# EAGLE design old_main_board (EAGLE 7.7.0)
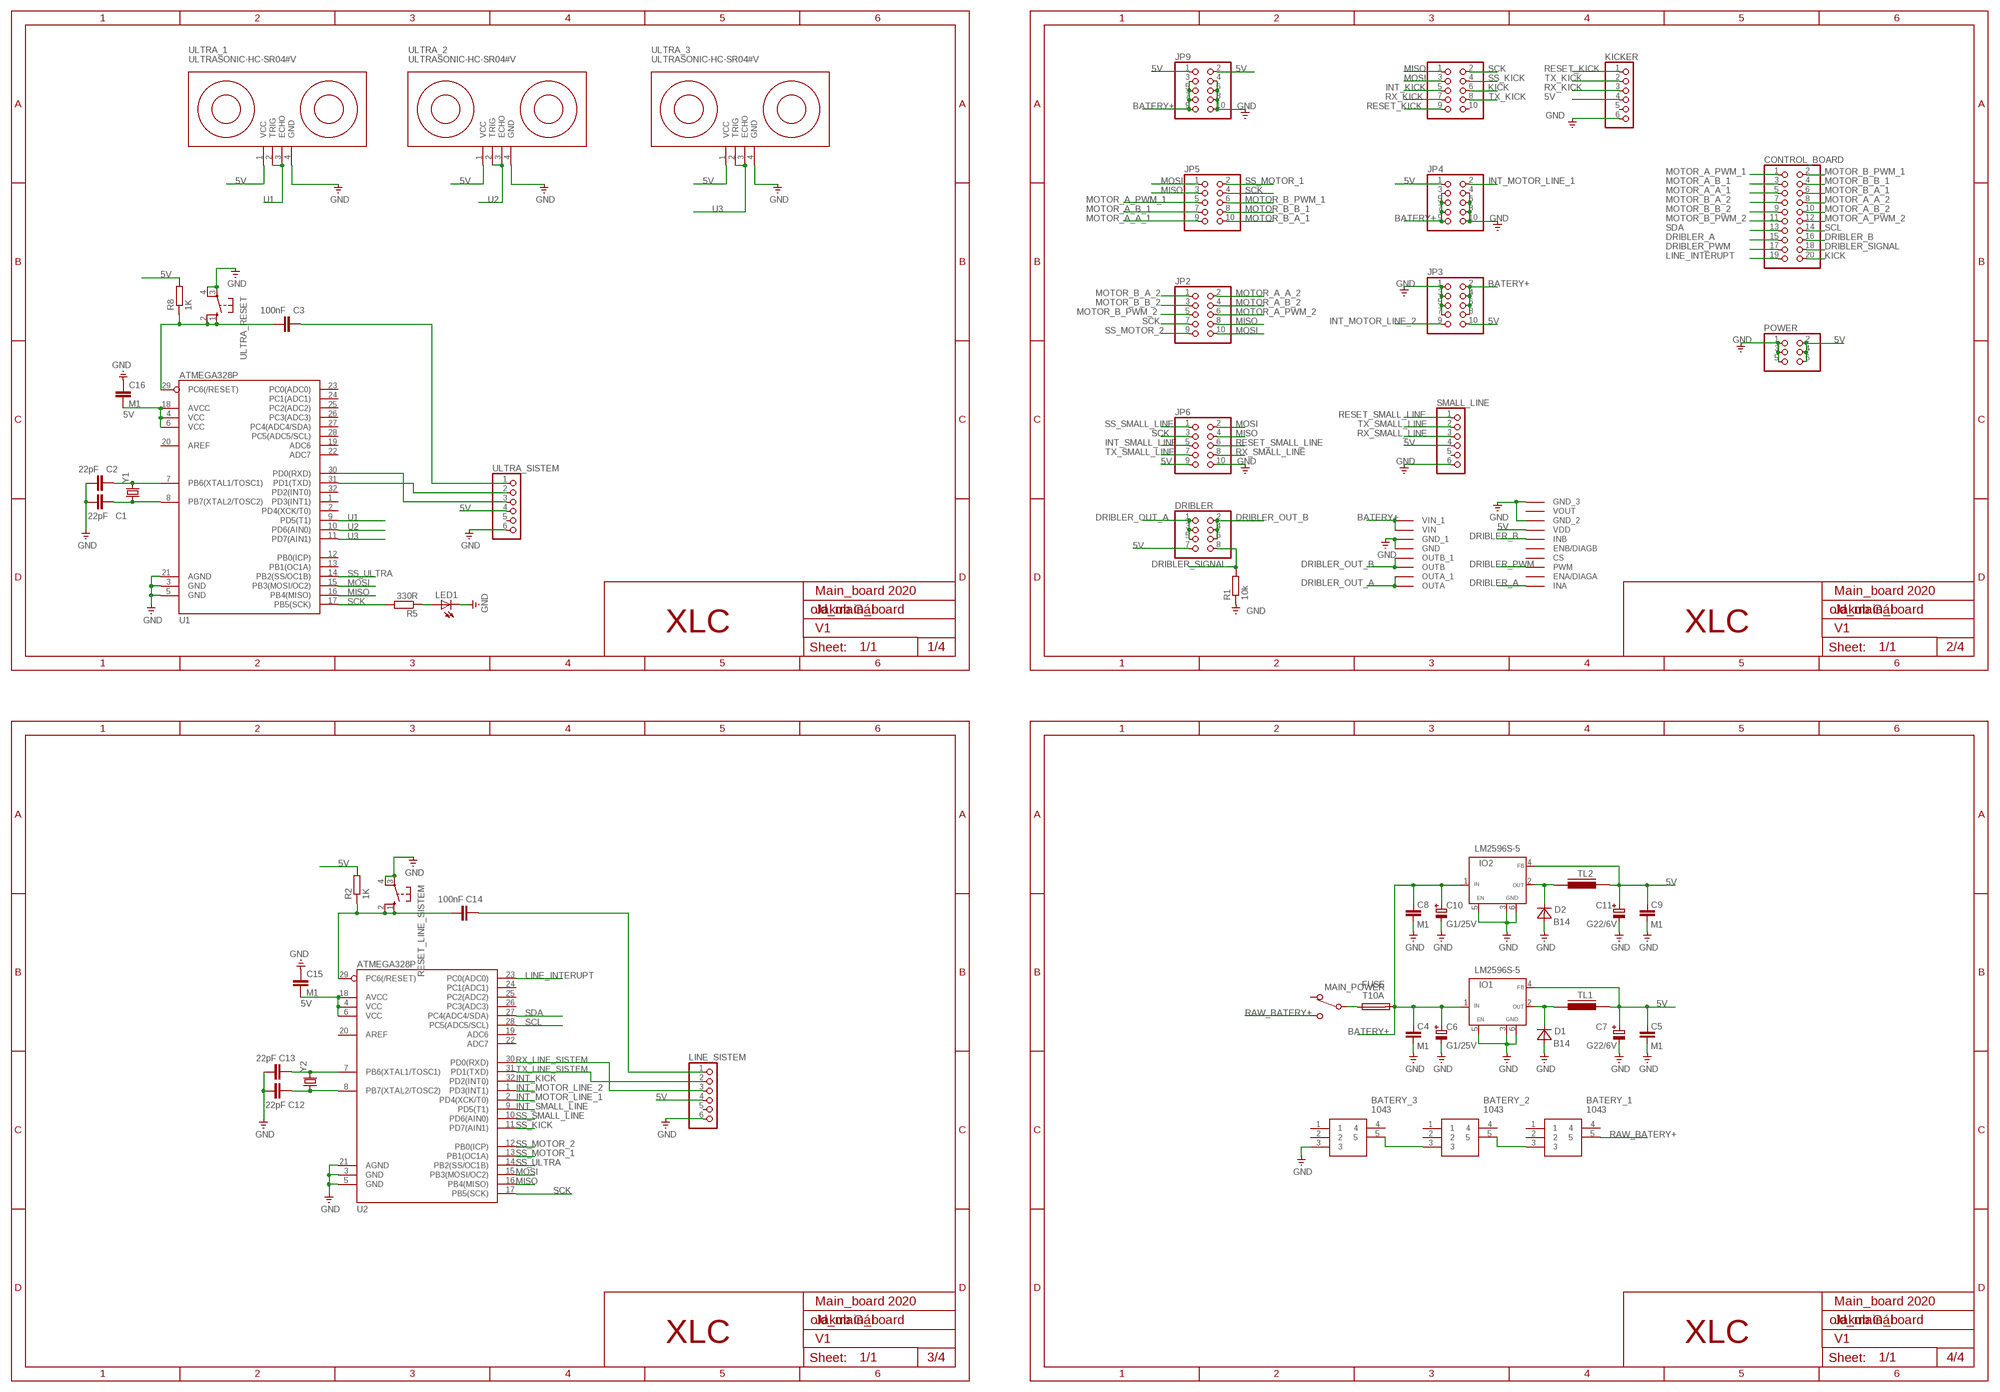
[diagram p0: schematic, sheet 1]

## Parts
BATERY_1  1043  [1043]
BATERY_2  1043  [1043]
BATERY_3  1043  [1043]
C1  22pF  C-EUC0603  [C0603]
C2  22pF  C-EUC0603  [C0603]
C3  100nF  C-EUC0603  [C0603]
C4  M1  KOND-KERAM1206-SMD  [SMD-1206]
C5  M1  KOND-KERAM1206-SMD  [SMD-1206]
C6  G1/25V  KOND-ELEKTD-SMD  [SMD-ELE-D]
C7  G22/6V  KOND-ELEKTD-SMD  [SMD-ELE-D]
C8  M1  KOND-KERAM1206-SMD  [SMD-1206]
C9  M1  KOND-KERAM1206-SMD  [SMD-1206]
C10  G1/25V  KOND-ELEKTD-SMD  [SMD-ELE-D]
C11  G22/6V  KOND-ELEKTD-SMD  [SMD-ELE-D]
C12  22pF  C-EUC0603  [C0603]
C13  22pF  C-EUC0603  [C0603]
C14  100nF  C-EUC0603  [C0603]
C15  M1  C-EUC0603  [C0603]
C16  M1  C-EUC0603  [C0603]
CONTROL_BOARD  PINHD-2X10_2.54-SMD  [2X10SMD]
D1  B14  DIODASMD-3,6X5,5  [D-3,6X5,5]
D2  B14  DIODASMD-3,6X5,5  [D-3,6X5,5]
DRIBLER  PINHD-2X4_2.54-SMD  [2X04SMD]
FUSE  T10A  POISTKA2A  [SH22,5A]
IO1  LM2596S-5  LM2596S  [TO263-5]
IO2  LM2596S-5  LM2596S  [TO263-5]
JP2  PINHD-2X5_2.54-SMD  [2X05SMD]
JP3  PINHD-2X5_2.54-SMD  [2X05SMD]
JP4  PINHD-2X5_2.54-SMD  [2X05SMD]
JP5  PINHD-2X5_2.54-SMD  [2X05SMD]
JP6  PINHD-2X5_2.54-SMD  [2X05SMD]
JP8  PINHD-2X5_2.54-SMD  [2X05SMD]
JP9  PINHD-2X5_2.54-SMD  [2X05SMD]
KICKER  PINHD-1X6  [1X06]
LED1  LEDCHIPLED_0603  [CHIPLED_0603]
LINE_SISTEM  PINHD-1X6  [1X06]
MAIN_POWER  PREP-1PB  [P-B069B]
POWER  PINHD-2X3_2.54-SMD  [2X03SMD]
R1  10k  R-EU_R0603  [R0603]
R2  1K  R-EU_R0603  [R0603]
R5  330R  R-EU_R0603  [R0603]
R8  1K  R-EU_R0603  [R0603]
RESET_LINE_SISTEM  10-XX  [B3F-10XX]
SMALL_LINE  PINHD-1X6  [1X06]
TL1  INDUK-TLSMD1  [INDUK-TL]
TL2  INDUK-TLSMD1  [INDUK-TL]
U1  ATMEGA328P  ATMEGA328_SMT  [TQFP32-08]
U2  ATMEGA328P  ATMEGA328_SMT  [TQFP32-08]
U$4  MOTOR_DRIVER  [MOTOR_DRIVER]
ULTRA_1  ULTRASONIC-HC-SR04#V  [ULTRASONIC-HC-SR04#V]
ULTRA_2  ULTRASONIC-HC-SR04#V  [ULTRASONIC-HC-SR04#V]
ULTRA_3  ULTRASONIC-HC-SR04#V  [ULTRASONIC-HC-SR04#V]
ULTRA_RESET  10-XX  [B3F-10XX]
ULTRA_SISTEM  PINHD-1X6  [1X06]
Y1  CRYSTALHC49US  [HC49US]
Y2  CRYSTALHC49US  [HC49US]

## Nets
5V: C5.2 C7.PLUS C9.2 C11.PLUS C15.2 C16.2 DRIBLER.7 IO1.4(FB) IO2.4(FB) JP3.10 JP4.1 JP6.9 JP9.1 JP9.2 KICKER.4 LINE_SISTEM.4 POWER.2 POWER.4 POWER.6 R2.2 R8.2 SMALL_LINE.4 TL1.2 TL2.2 U1.4(VCC) U1.6(VCC) U1.18(AVCC) U2.4(VCC) U2.6(VCC) U2.18(AVCC) U$4.VDD ULTRA_1.1(VCC) ULTRA_2.1(VCC) ULTRA_3.1(VCC) ULTRA_SISTEM.4
BATERY+: C4.2 C6.PLUS C8.2 C10.PLUS FUSE.2 IO1.1(IN) IO2.1(IN) JP3.2 JP3.4 JP3.6 JP3.8 JP4.3 JP4.5 JP4.7 JP4.9 JP9.3 JP9.5 JP9.7 JP9.9 U$4.VIN U$4.VIN_1
DRIBLER_A: CONTROL_BOARD.15 U$4.INA
DRIBLER_B: CONTROL_BOARD.16 U$4.INB
DRIBLER_OUT_A: DRIBLER.1 DRIBLER.3 DRIBLER.5 U$4.OUTA U$4.OUTA_1
DRIBLER_OUT_B: DRIBLER.2 DRIBLER.4 DRIBLER.6 U$4.OUTB U$4.OUTB_1
DRIBLER_PWM: CONTROL_BOARD.17 U$4.PWM
DRIBLER_SIGNAL: CONTROL_BOARD.18 DRIBLER.8 R1.2
GND: BATERY_3.3 C1.1 C2.1 C4.1 C5.1 C6.MINUS C7.MINUS C8.1 C9.1 C10.MINUS C11.MINUS C12.1 C13.1 C15.1 C16.1 D1.A D2.A IO1.3(GND) IO1.5(EN) IO1.6(GND) IO2.3(GND) IO2.5(EN) IO2.6(GND) JP3.1 JP3.3 JP3.5 JP3.7 JP4.4 JP4.6 JP4.8 JP4.10 JP6.10 JP9.4 JP9.6 JP9.8 JP9.10 KICKER.6 LED1.C LINE_SISTEM.6 POWER.1 POWER.3 POWER.5 R1.1 RESET_LINE_SISTEM.3(P) RESET_LINE_SISTEM.4(P1) SMALL_LINE.6 U1.3(GND) U1.5(GND) U1.21(AGND) U2.3(GND) U2.5(GND) U2.21(AGND) U$4.GND U$4.GND_1 U$4.GND_2 U$4.GND_3 ULTRA_1.4(GND) ULTRA_2.4(GND) ULTRA_3.4(GND) ULTRA_RESET.3(P) ULTRA_RESET.4(P1) ULTRA_SISTEM.6
INT_KICK: JP8.5 U2.32(PD2(INT0))
INT_MOTOR_LINE_1: JP4.2 U2.2(PD4(XCK/T0))
INT_MOTOR_LINE_2: JP3.9 U2.1(PD3(INT1))
INT_SMALL_LINE: JP6.5 U2.9(PD5(T1))
KICK: CONTROL_BOARD.20 JP8.6
LINE_INTERUPT: CONTROL_BOARD.19 U2.23(PC0(ADC0))
MISO: JP2.8 JP5.3 JP6.4 JP8.1 U1.16(PB4(MISO)) U2.16(PB4(MISO))
MOSI: JP2.10 JP5.1 JP6.2 JP8.3 U1.15(PB3(MOSI/OC2)) U2.15(PB3(MOSI/OC2))
MOTOR_A_A_1: CONTROL_BOARD.5 JP5.9
MOTOR_A_A_2: CONTROL_BOARD.8 JP2.2
MOTOR_A_B_1: CONTROL_BOARD.3 JP5.7
MOTOR_A_B_2: CONTROL_BOARD.10 JP2.4
MOTOR_A_PWM_1: CONTROL_BOARD.1 JP5.5
MOTOR_A_PWM_2: CONTROL_BOARD.12 JP2.6
MOTOR_B_A_1: CONTROL_BOARD.6 JP5.10
MOTOR_B_A_2: CONTROL_BOARD.7 JP2.1
MOTOR_B_B_1: CONTROL_BOARD.4 JP5.8
MOTOR_B_B_2: CONTROL_BOARD.9 JP2.3
MOTOR_B_PWM_1: CONTROL_BOARD.2 JP5.6
MOTOR_B_PWM_2: CONTROL_BOARD.11 JP2.5
N$1: BATERY_1.3 BATERY_2.5
N$2: BATERY_2.3 BATERY_3.5
N$3: D2.K IO2.2(OUT) TL2.1
N$4: FUSE.1 MAIN_POWER.2(2-COM)
N$5: C13.2 U2.7(PB6(XTAL1/TOSC1)) Y2.2
N$6: D1.K IO1.2(OUT) TL1.1
N$7: C2.2 U1.7(PB6(XTAL1/TOSC1)) Y1.2
N$8: C1.2 U1.8(PB7(XTAL2/TOSC2)) Y1.1
N$9: C12.2 U2.8(PB7(XTAL2/TOSC2)) Y2.1
N$12: C14.2 LINE_SISTEM.1
N$13: C14.1 R2.1 RESET_LINE_SISTEM.1(S) RESET_LINE_SISTEM.2(S1) U2.29(PC6(/RESET))
N$16: U1.30(PD0(RXD)) ULTRA_SISTEM.3
N$17: U1.31(PD1(TXD)) ULTRA_SISTEM.2
N$18: C3.2 ULTRA_SISTEM.1
N$19: C3.1 R8.1 U1.29(PC6(/RESET)) ULTRA_RESET.1(S) ULTRA_RESET.2(S1)
N$20: LED1.A R5.1
RAW_BATERY+: BATERY_1.5 MAIN_POWER.1(1-OFF)
RESET_KICK: JP8.9 KICKER.1
RESET_SMALL_LINE: JP6.6 SMALL_LINE.1
RX_KICK: JP8.7 KICKER.3
RX_LINE_SISTEM: LINE_SISTEM.3 U2.30(PD0(RXD))
RX_SMALL_LINE: JP6.8 SMALL_LINE.3
SCK: JP2.7 JP5.4 JP6.3 JP8.2 R5.2 U1.17(PB5(SCK)) U2.17(PB5(SCK))
SCL: CONTROL_BOARD.14 U2.28(PC5(ADC5/SCL))
SDA: CONTROL_BOARD.13 U2.27(PC4(ADC4/SDA))
SS_KICK: JP8.4 U2.11(PD7(AIN1))
SS_MOTOR_1: JP5.2 U2.13(PB1(OC1A))
SS_MOTOR_2: JP2.9 U2.12(PB0(ICP))
SS_SMALL_LINE: JP6.1 U2.10(PD6(AIN0))
SS_ULTRA: U1.14(PB2(SS/OC1B)) U2.14(PB2(SS/OC1B))
TX_KICK: JP8.8 KICKER.2
TX_LINE_SISTEM: LINE_SISTEM.2 U2.31(PD1(TXD))
TX_SMALL_LINE: JP6.7 SMALL_LINE.2
U1: U1.9(PD5(T1)) ULTRA_1.2(TRIG) ULTRA_1.3(ECHO)
U2: U1.10(PD6(AIN0)) ULTRA_2.2(TRIG) ULTRA_2.3(ECHO)
U3: U1.11(PD7(AIN1)) ULTRA_3.2(TRIG) ULTRA_3.3(ECHO)
Unconnected: BATERY_1.1 BATERY_1.2 BATERY_1.4 BATERY_2.1 BATERY_2.2 BATERY_2.4 BATERY_3.1 BATERY_3.2 BATERY_3.4 JP8.10 KICKER.5 LINE_SISTEM.5 MAIN_POWER.3(3-ON) SMALL_LINE.5 U1.1(PD3(INT1)) U1.2(PD4(XCK/T0)) U1.12(PB0(ICP)) U1.13(PB1(OC1A)) U1.19(ADC6) U1.20(AREF) U1.22(ADC7) U1.23(PC0(ADC0)) U1.24(PC1(ADC1)) U1.25(PC2(ADC2)) U1.26(PC3(ADC3)) U1.27(PC4(ADC4/SDA)) U1.28(PC5(ADC5/SCL)) U1.32(PD2(INT0)) U2.19(ADC6) U2.20(AREF) U2.22(ADC7) U2.24(PC1(ADC1)) U2.25(PC2(ADC2)) U2.26(PC3(ADC3)) U$4.CS U$4.ENA/DIAGA U$4.ENB/DIAGB U$4.VOUT ULTRA_SISTEM.5

## Notes on the sheet
- Main_board 2020 | Main_board 2020
- Jakub Gál | Jakub Gál
- XLC | V1 | XLC | V1
- 1/4 | 2/4
- Main_board 2020 | Main_board 2020
- Jakub Gál | Jakub Gál
- XLC | V1 | XLC | V1
- 3/4 | 4/4

## Library data of the parts
BATERY_1-BATERY_3 = SamacSys_Parts:1043: KEYSTONE - 1043 - BATTERY HOLDER, 18650, TH Source: Datasheet <https://componentsearchengine.com/Datasheets/1/1043.pdf>; DESCRIPTION: KEYSTONE - 1043 - BATTERY HOLDER, 18650, TH; HEIGHT: mm; MANUFACTURER_NAME: Keystone Electronics; MANUFACTURER_PART_NUMBER: 1043; MOUSER_PART_NUMBER: 534-1043; MOUSER_PRICE-STOCK: https://www.mouser.com/Search/Refine.aspx?Keyword=534-1043
C1-C3 C12-C14 = rcl@1:C-EU: CAPACITOR, European symbol
C4 C5 C8 C9 = TABOR K1:KOND-KERAM: Kondenzátor keramicky
C6 C7 C10 C11 = TABOR K1:KOND-ELEKT: Kondenzátor elektrolyticky
C15 C16 = rcl:C-EU: CAPACITOR, European symbol; SPICEPREFIX: C
CONTROL_BOARD = pinhead-1:PINHD-2X10: PIN HEADER
D1 D2 = TABOR K1:DIODA: Dioda
DRIBLER = pinhead-1:PINHD-2X4: PIN HEADER
FUSE = TABOR K1:POISTKA2: Drziak sklopistky SH22,5A / vzdialenost vyvodov 22,5 mm /
IO1 IO2 = TABOR K1:LM2596: DC/DC pulzny regulator STEP-DOWN / 3A upraveny podla katalogu
JP2-JP6 JP8 JP9 = pinhead-1:PINHD-2X5: PIN HEADER
KICKER LINE_SISTEM SMALL_LINE ULTRA_SISTEM = pinhead:PINHD-1X6: PIN HEADER
LED1 = audio amplifier example:LED
MAIN_POWER = TABOR K1:PREP-1P: 1-polovy prepinac
POWER = pinhead-1:PINHD-2X3: PIN HEADER
R1 R2 R5 R8 = rcl:R-EU_: RESISTOR, European symbol; SPICEPREFIX: R
RESET_LINE_SISTEM ULTRA_RESET = switch-omron:10-XX: OMRON SWITCH; MPN: B3F-1000; OC_FARNELL: 176432; OC_NEWARK: 36M3542
TL1 TL2 = TABOR K1:INDUK-TL: Tlmivka
U1 U2 = SparkFun-DigitalIC:ATMEGA328_SMT: 32-Pin Atmega328 part Commonly used on Arduino compatible boards Available in QFP and QFN packages TQFP is IC-09069 QFN is non-stock; PROD_ID: IC-09069
U$4 = Moja:MOTOR_DRIVER
ULTRA_1-ULTRA_3 = diy-modules:ULTRASONIC-HC-SR04: Ultrasonic Ranging Module HC-SR04 More details available here: http://randomnerdtutorials.com/complete-guide-for-ultrasonic-sensor-hc-sr04/ Click here to find device on ebay.com <http://www.ebay.com/sch/hc+sr04+ultrasonic>
Y1 Y2 = SparkFun-FreqCtrl:CRYSTAL: Various standard crystals. Proven footprints. Spark Fun Electronics SKU : COM-00534

## Board
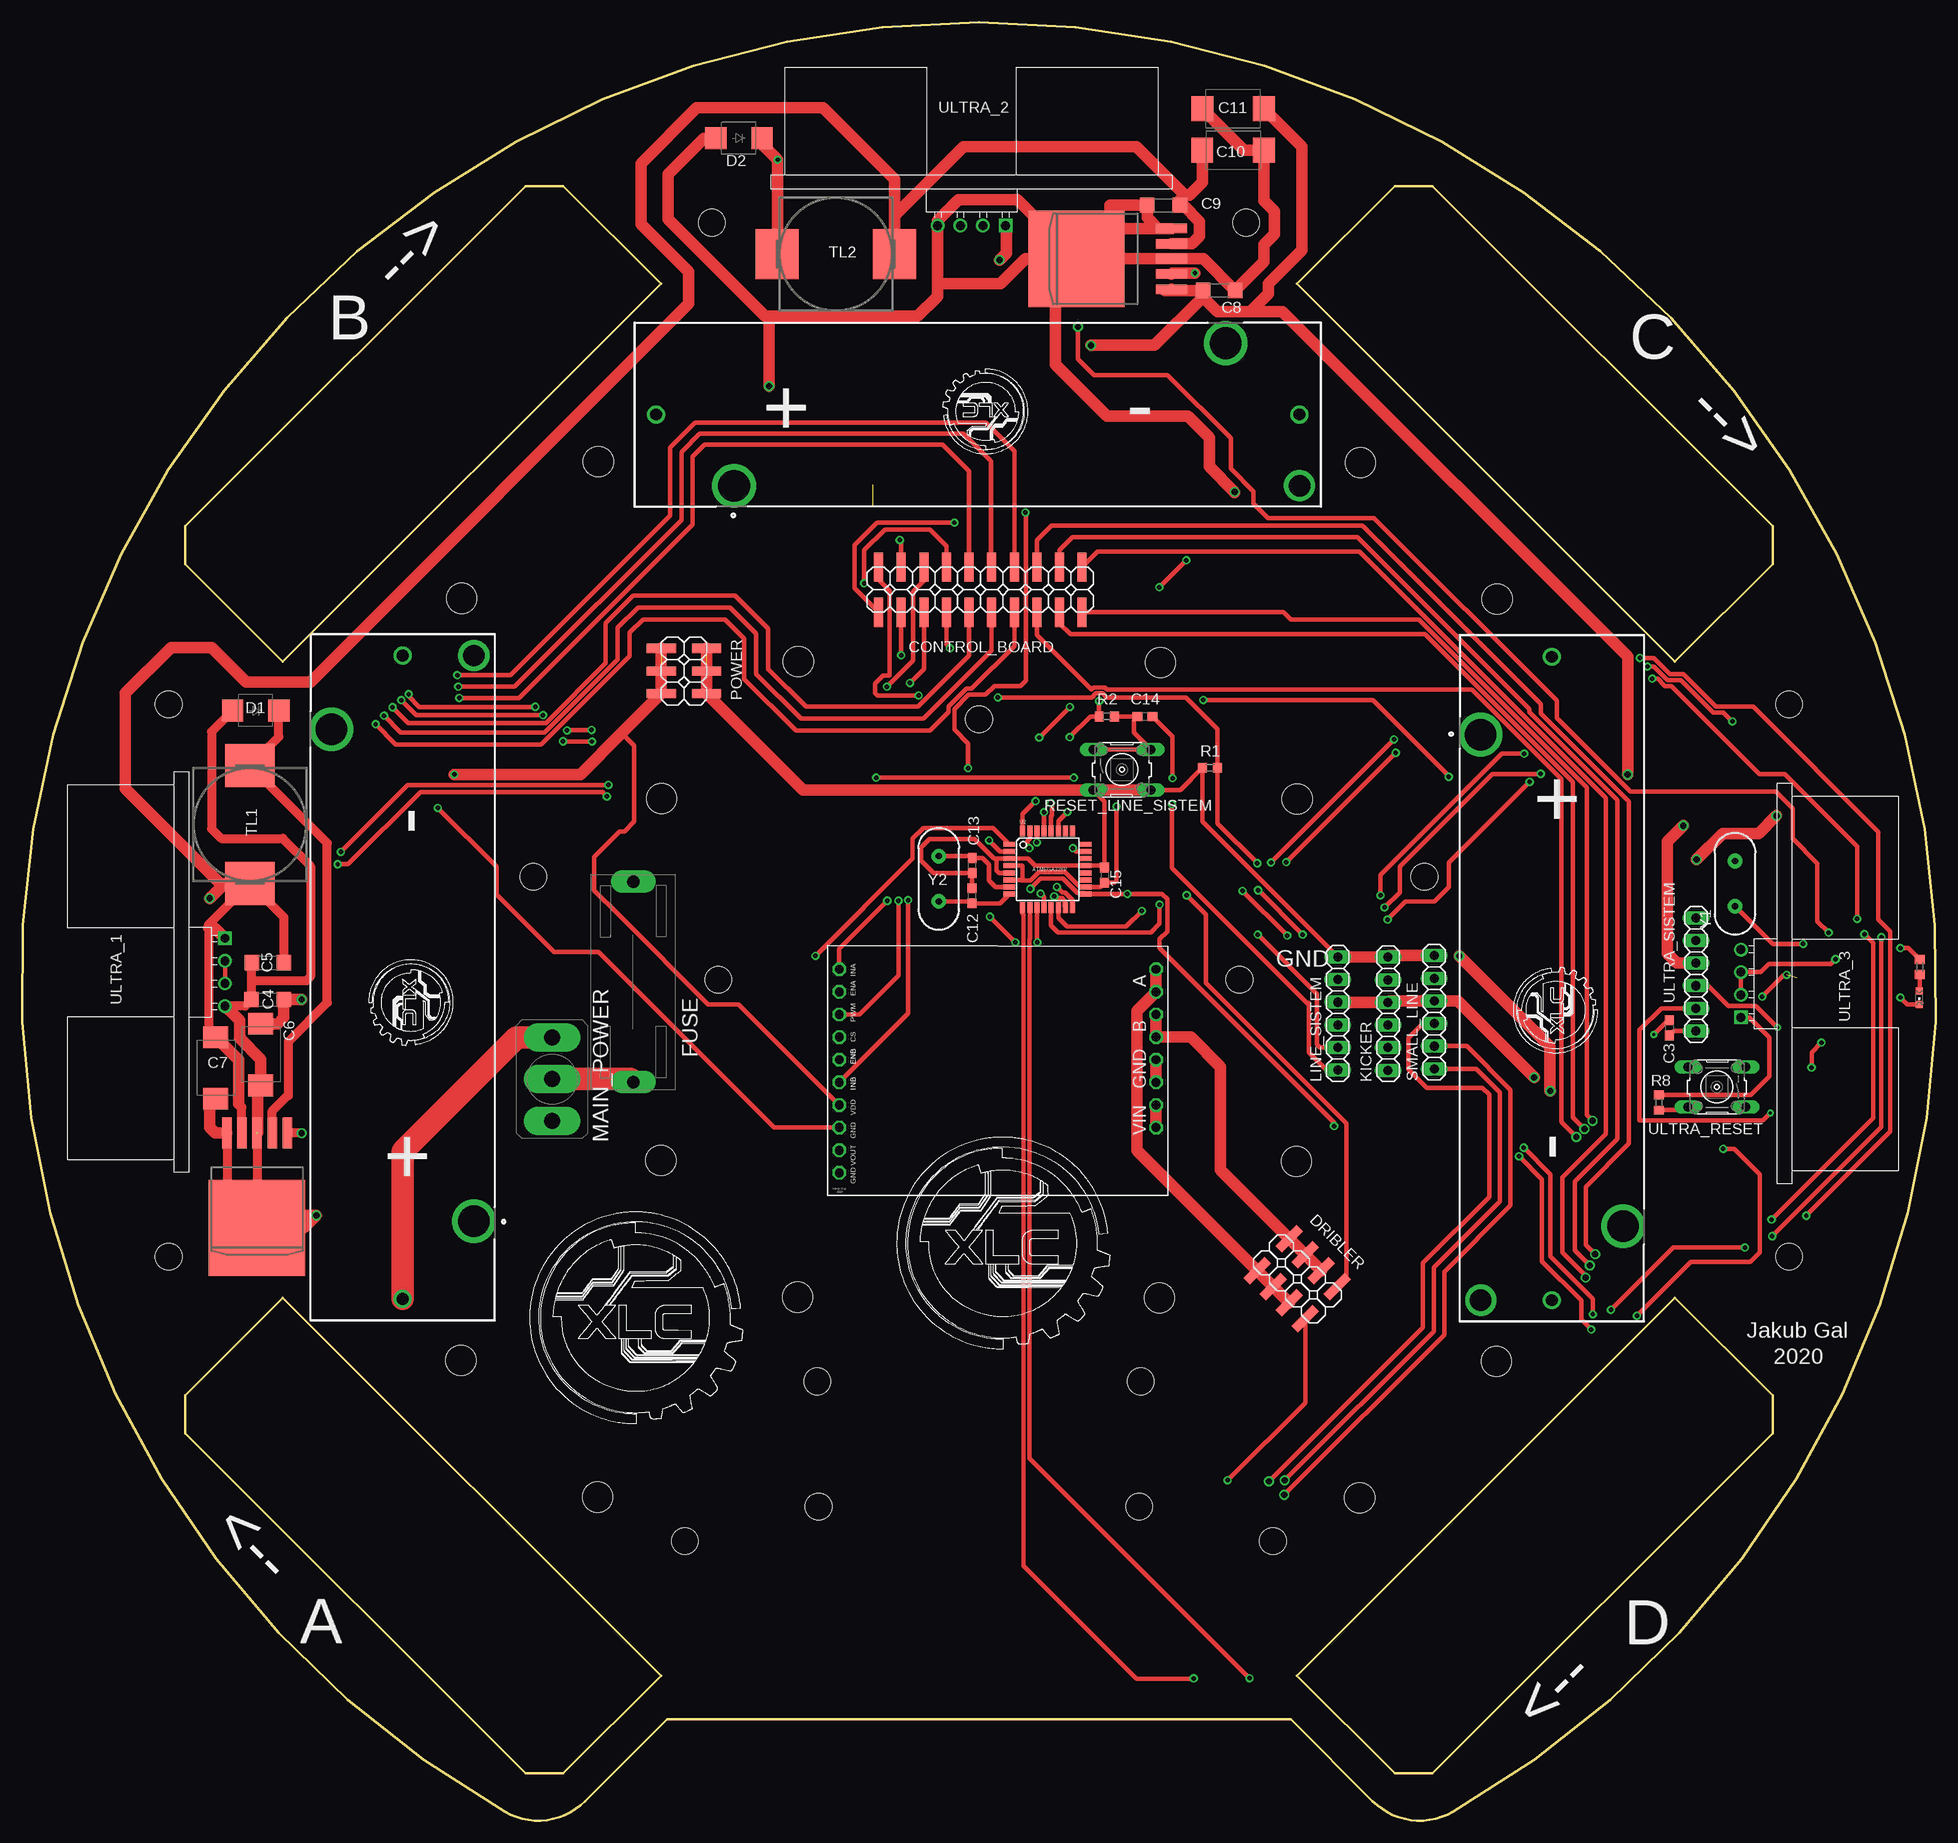
[diagram p1: board, top side]
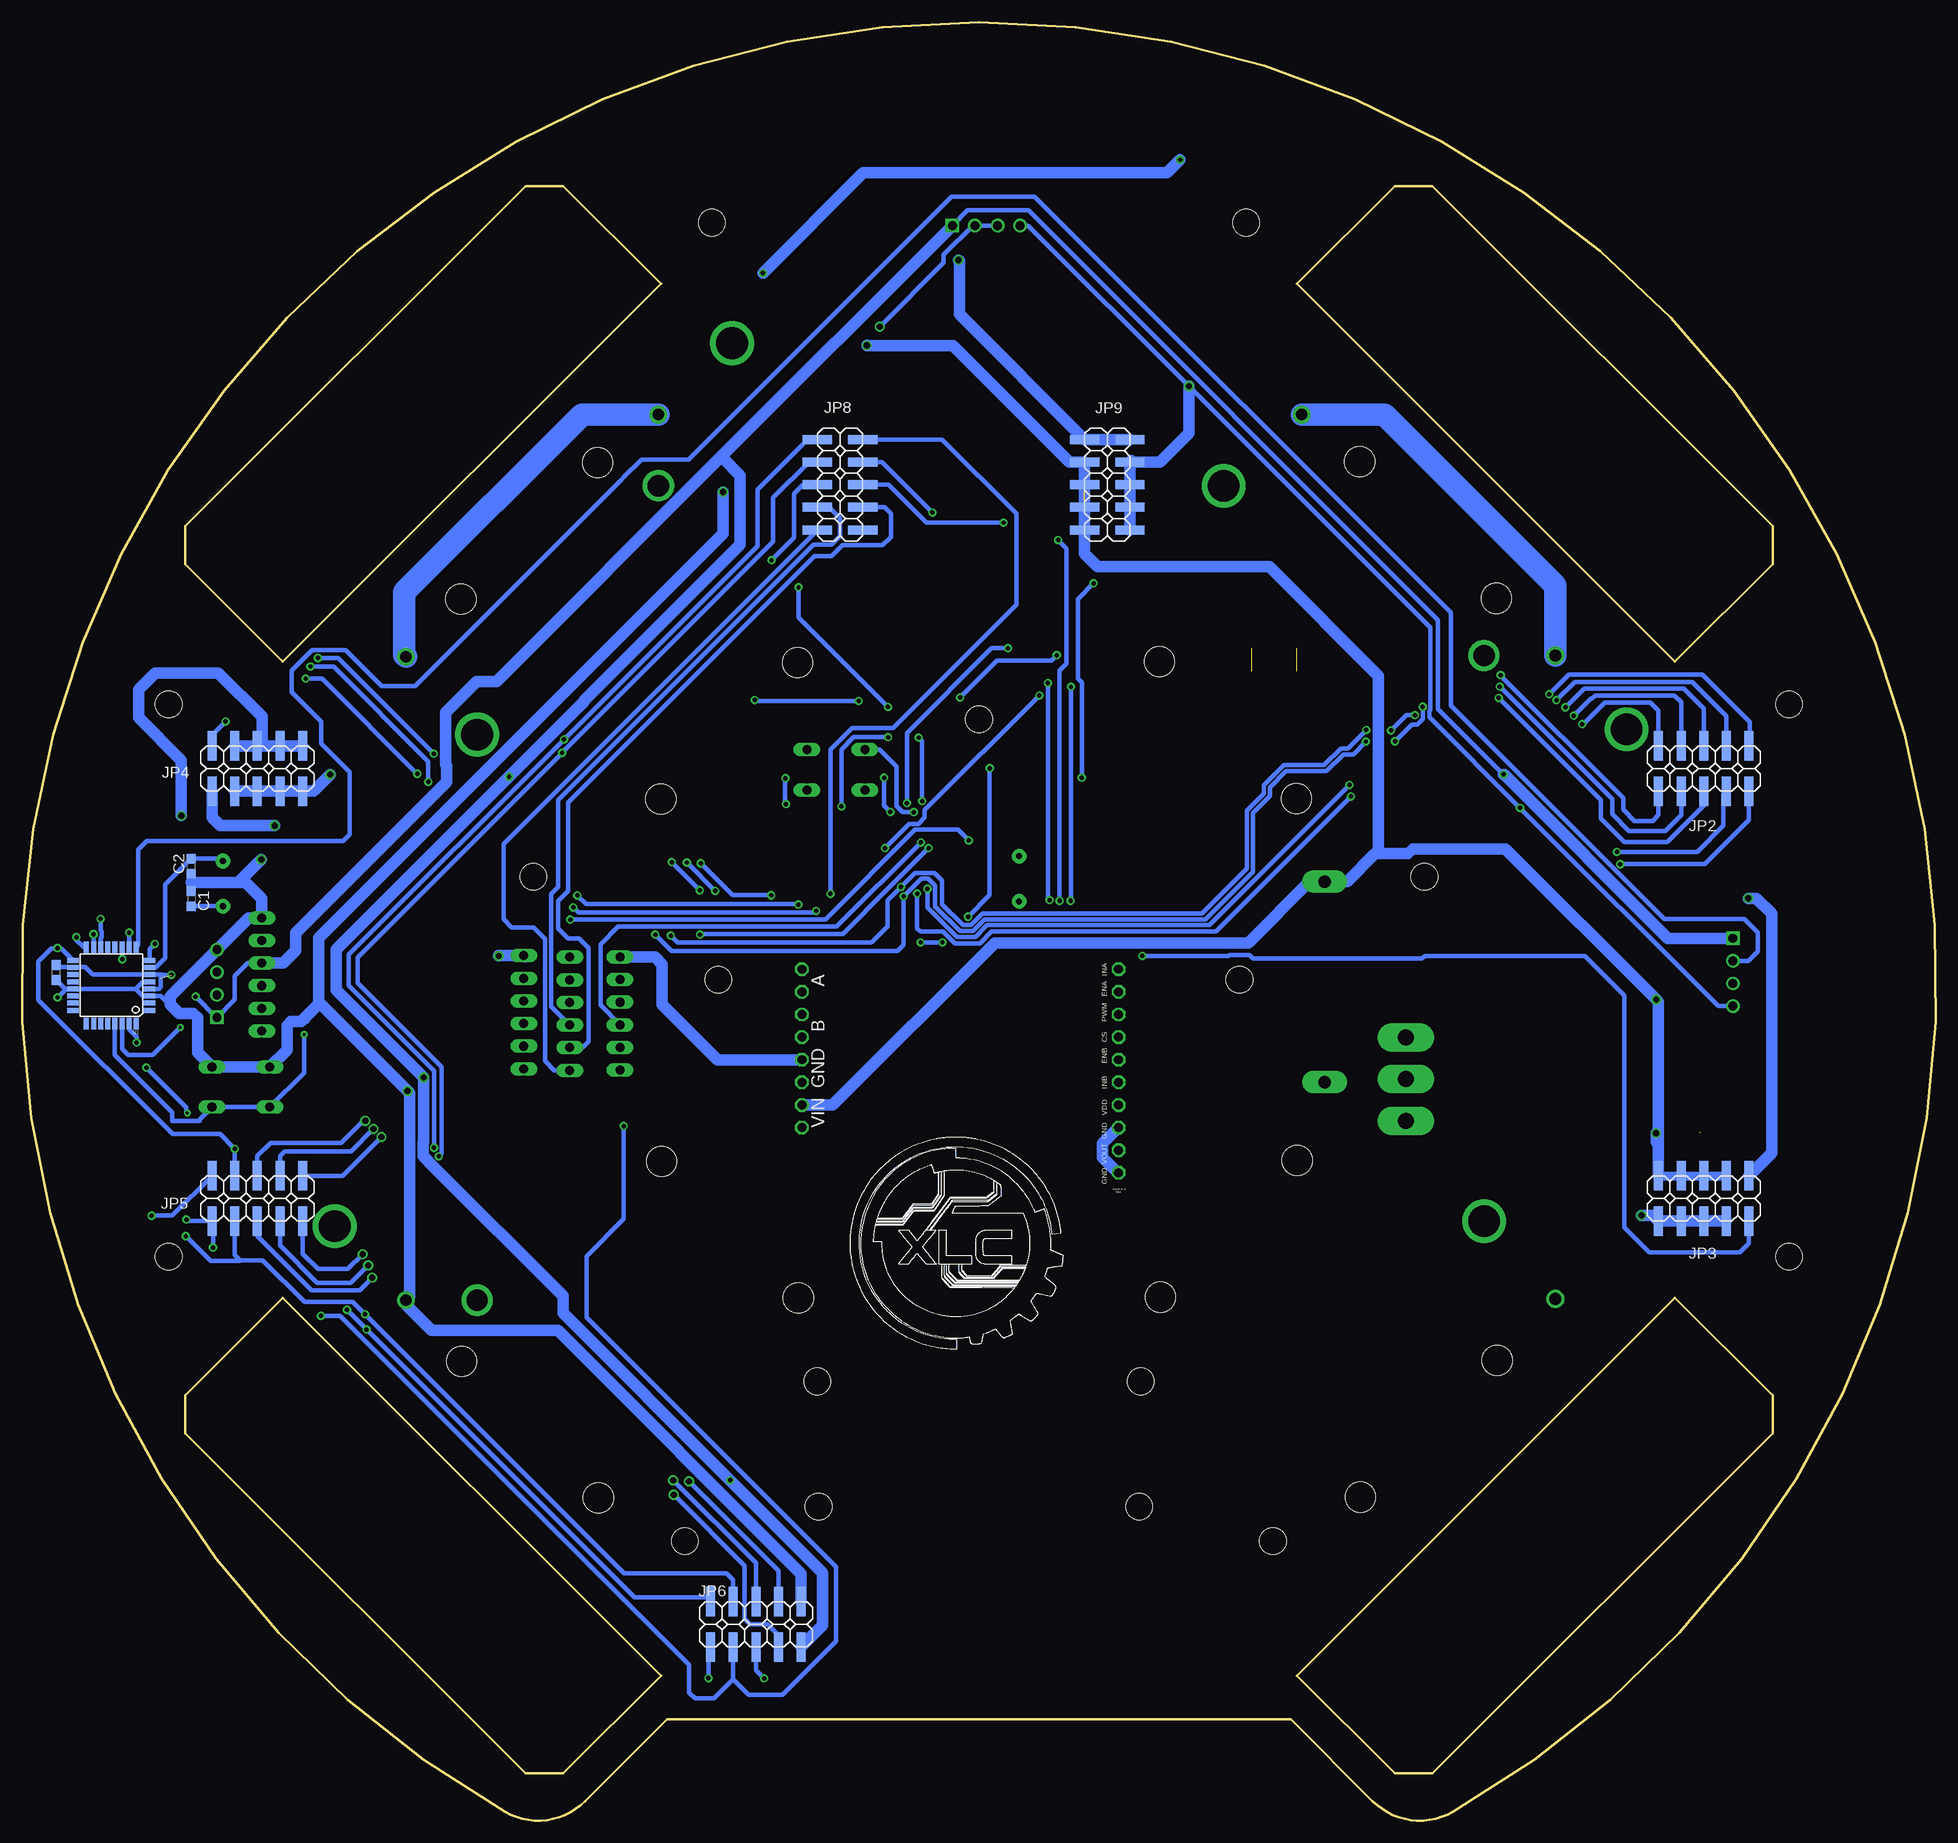
[diagram p2: board, bottom side, seen from below]

Size 214.79 x 201.88 mm. Coordinates in mm from the lower left corner, seen from the top.
Outline: 142.4,11.38 151.59,2.19 arc75 160.61,0.98 arc301 54.19,0.98 arc75 63.2,2.19 72.4,11.38 142.4,11.38
Outline: 185.53,130.09 143.11,172.52 154.07,183.48 158.31,183.48 196.49,145.3 196.49,141.05 185.53,130.09
Outline: 71.69,172.52 29.26,130.09 18.3,141.05 18.3,145.3 56.48,183.48 60.73,183.48 71.69,172.52
Outline: 143.11,16.25 185.53,58.68 196.49,47.72 196.49,43.47 158.31,5.29 154.07,5.29 143.11,16.25
Outline: 18.3,47.72 29.26,58.68 71.69,16.25 60.73,5.29 56.48,5.29 18.3,43.47 18.3,47.72
Copper layers (1*16): Top 0.035mm / dielectric 1.5mm / Bottom 0.035mm
Design rules "default": minimum track width 6mil, minimum drill 0.35mm, track to track 6mil, track to pad 6mil, pad to pad 6mil, via to via 6mil, smd to smd 6mil, copper to edge 40mil, drill to drill 6mil, minimum pad ring 10mil, minimum via ring 8mil, stop-mask expansion 4mil, vias tented up to drill 0mil, thermal gap 10mil
Holes 3 mm at 78.15,94.38 89.24,49.3 89.4,35.23 16.44,125.31 107.4,123.63 198.35,125.31 77.4,179.38 137.4,179.38 140.4,31.38 157.4,105.94 57.4,105.94 198.35,63.31 136.64,94.38 16.44,63.31 74.4,31.38 125.56,49.3 125.4,35.23
Holes 3.4 mm at 71.68,74.1 165.47,51.56 49.23,51.65 64.57,36.31 87.03,58.76 150.13,36.22 143.02,74.01 150.22,152.46 64.66,152.55 71.77,114.76 143.11,114.67 165.56,137.12 49.32,137.21 87.12,130.1 127.77,130.01 127.68,58.67

### Footprints (pad centres in the part's own frame; a part is rotated, then mirrored left to right if it is on the bottom)
1043 = drill 3.55 pad 4.9: 1 0,0; 4 55.2,16 | drill 2.39 pad 3.5: 2 63.48,0 | drill 1.32 pad 2: 3 63.48,8; 5 -8.74,8
C0603 = smd 1.1 x 1: 1 -0.85,0; 2 0.85,0
SMD-1206 = smd 1.626 x 1.702: 1 -1.803,0; 2 1.803,0
SMD-ELE-D = smd 2.438 x 2.794: MINUS 3.454,0; PLUS -3.454,0
2X10SMD = smd 1.016 x 3.302: 1 -1.27,-3.81; 2 -1.27,1.27; 3 1.27,-3.81; 4 1.27,1.27; 5 3.81,-3.81; 6 3.81,1.27; 7 6.35,-3.81; 8 6.35,1.27; 9 8.89,-3.81; 10 8.89,1.27; 11 11.43,-3.81; 12 11.43,1.27; 13 13.97,-3.81; 14 13.97,1.27; 15 16.51,-3.81; 16 16.51,1.27; 17 19.05,-3.81; 18 19.05,1.27; 19 21.59,-3.81; 20 21.59,1.27
D-3,6X5,5 = smd 2.388 x 2.489: A 2.591,0; K -2.591,0
2X04SMD = smd 1.016 x 3.302: 1 -1.27,-3.81; 2 -1.27,1.27; 3 1.27,-3.81; 4 1.27,1.27; 5 3.81,-3.81; 6 3.81,1.27; 7 6.35,-3.81; 8 6.35,1.27
SH22,5A = drill 1.397 pad 2.54 long: 1 -11.252,0; 2 11.252,0
TO263-5 = smd 1.067 x 3.505: 1 -3.404,0.762; 2 -1.702,0.762; 3 0,0.762; 4 1.702,0.762; 5 3.404,0.762 | smd 10.82 x 10.82: 6 0,11.43
2X05SMD = smd 1.016 x 3.302: 1 -1.27,-3.81; 2 -1.27,1.27; 3 1.27,-3.81; 4 1.27,1.27; 5 3.81,-3.81; 6 3.81,1.27; 7 6.35,-3.81; 8 6.35,1.27; 9 8.89,-3.81; 10 8.89,1.27
1X06 = drill 1.016 long: 1 -6.35,0; 2 -3.81,0; 3 -1.27,0; 4 1.27,0; 5 3.81,0; 6 6.35,0
CHIPLED_0603 = smd 0.8 x 0.8: A 0,-0.75; C 0,0.75
P-B069B = drill 1.803 pad 3.175 long: 1 -4.699,0; 2 0,0; 3 4.699,0
2X03SMD = smd 1.016 x 3.302: 1 -1.27,-3.81; 2 -1.27,1.27; 3 1.27,-3.81; 4 1.27,1.27; 5 3.81,-3.81; 6 3.81,1.27
R0603 = smd 1 x 1.1: 1 -0.85,0; 2 0.85,0
B3F-10XX = drill 1.016 long: 1 -3.251,2.261; 2 3.251,2.261; 3 -3.251,-2.261; 4 3.251,-2.261
INDUK-TL = smd 4.826 x 5.588: 1 -6.604,0; 2 6.604,0
TQFP32-08 = smd 1.27 x 0.559: 1 -4.293,2.8; 2 -4.293,2; 3 -4.293,1.2; 4 -4.293,0.4; 5 -4.293,-0.4; 6 -4.293,-1.2; 7 -4.293,-2; 8 -4.293,-2.8; 17 4.293,-2.8; 18 4.293,-2; 19 4.293,-1.2; 20 4.293,-0.4; 21 4.293,0.4; 22 4.293,1.2; 23 4.293,2; 24 4.293,2.8 | smd 0.559 x 1.27: 9 -2.8,-4.293; 10 -2,-4.293; 11 -1.2,-4.293; 12 -0.4,-4.293; 13 0.4,-4.293; 14 1.2,-4.293; 15 2,-4.293; 16 2.8,-4.293; 25 2.8,4.293; 26 2,4.293; 27 1.2,4.293; 28 0.4,4.293; 29 -0.4,4.293; 30 -1.2,4.293; 31 -2,4.293; 32 -2.8,4.293
MOTOR_DRIVER = drill 1 octagon: CS -2.54,-17.78; ENA/DIAGA -7.62,-17.78; ENB/DIAGB 0,-17.78; GND 0,17.78; GND_1 2.54,17.78; GND_2 7.62,-17.78; GND_3 12.7,-17.78; INA -10.16,-17.78; INB 2.54,-17.78; OUTA -10.16,17.78; OUTA_1 -7.62,17.78; OUTB -5.08,17.78; OUTB_1 -2.54,17.78; PWM -5.08,-17.78; VDD 5.08,-17.78; VIN 5.08,17.78; VIN_1 7.62,17.78; VOUT 10.16,-17.78
ULTRASONIC-HC-SR04#V = drill 1 square: 1 -3.81,0 | drill 1: 2 -1.27,0; 3 1.27,0; 4 3.81,0
HC49US = drill 0.7 pad 1.651: 1 -2.54,0; 2 2.54,0

### Placement (x,y rotation side)
BATERY_1  50.7,67.3 90 top
BATERY_2  79.91,149.85 0 top
BATERY_3  163.73,121.91 270 top
C1  195.83,103.5 270 bottom
C2  195.82,107.13 90 bottom
C3  184.9,88.99 270 top
C4  27.56,92.17 0 top
C5  27.58,96.3 0 top
C6  26.78,85.99 270 top
C7  21.73,84.49 270 top
C8  134.36,171.77 180 top
C9  128.12,181.35 0 top
C10  135.94,192.17 180 top
C11  135.93,187.52 0 top
C12  106.61,103.82 270 top
C13  106.65,107.22 90 top
C14  126.03,123.96 0 top
C15  121.51,106.14 270 top
C16  210.98,95.2 90 bottom
CONTROL_BOARD  117.72,136.91 180 top
D1  26.21,124.61 180 top
D2  80.46,188.87 180 top
DRIBLER  142.23,63.53 315 top
FUSE  68.59,94.16 90 top
IO1  26.36,77.96 180 top
IO2  129.78,175.32 90 top
JP2  29.84,119.37 0 bottom
JP3  29.84,71.11 0 bottom
JP4  192.21,119.37 0 bottom
JP5  192.21,71.11 0 bottom
JP6  136.25,23.31 0 bottom
JP8  121.72,153.78 270 bottom
JP9  91.72,153.78 270 bottom
KICKER  153.33,90.58 90 top
LED1  212.97,92.38 180 top
LINE_SISTEM  147.69,90.6 90 top
MAIN_POWER  59.48,83.23 270 top
POWER  73.01,127.79 90 top
R1  133.34,118.19 0 top
R2  121.75,123.95 180 top
R5  213.02,95.83 90 top
R8  183.72,80.6 90 top
RESET_LINE_SISTEM  123.46,117.97 0 top
SMALL_LINE  158.51,90.74 90 top
TL1  25.56,111.82 270 top
TL2  91.34,175.85 0 top
U1  204.8,93.76 180 bottom
U2  115.11,106.8 0 top
U$4  109.5,85.41 270 top
ULTRA_1  22.76,95.24 270 top
ULTRA_2  106.58,179.06 180 top
ULTRA_3  192.94,93.97 90 top
ULTRA_RESET  190.25,82.35 180 top
ULTRA_SISTEM  187.9,94.99 90 top
Y1  192.27,105.19 90 top
Y2  102.89,105.73 90 top

### Tracks (layer width: path | path; a pad name or v marks a point on that pad's centre or on a via)
5V  (via drill 0.5, 0.7)  (2 unrouted)
  Top 0.508: ULTRA_3.1 193.88,90.16 196.14,87.9 196.14,83.55 194.04,81.45 R8.2 | v198.07,94.94 197.78,94.94 v195.33,92.49 | U2.4 112.23,107.2 112.31,107.12 112.31,105.71 112.15,105.56 | 112.15,105.56 112.11,105.6 U2.6 | U$4.VDD 80.44,91.61 77.01,91.61 67.15,101.47 66.92,101.7 64.2,104.42 64.2,108.17 67.07,111.04 67.61,111.04 68.7,112.13 68.7,120.69 67.3,122.09 66.92,121.7 | 112.15,105.56 113.19,105.56 114.11,106.48 117.03,106.48 118.72,104.79 U2.18 121.02,104.8 C15.2 122.63,105.29 122.84,105.5 v122.84,113.85 | v117.59,121.63 119.91,123.95 R2.2 v120.9,125.7 | v132.58,125.81 151.61,125.81 160.14,117.28 v160.14,117.18 | DRIBLER.7 144.02,46.92 v135.31,38.21
  Top 1.016: 24.3,80.43 24.65,80.08 IO1.4 | 22.15,87.53 C7.PLUS 20.91,88.77 20.91,100.22 20.91,100.57 TL1.2 29.38,101.4 C5.2
  Top 1.27: v109.7,175.2 110.48,175.98 110.48,178.97 ULTRA_2.1 | IO2.4 131.33,177.03 132.17,177.86 132.17,179.52 130.33,181.35 C9.2 129.92,181.89 130.51,182.48 | 24.3,80.43 24.3,85.38 22.15,87.53 | 130.51,182.48 131.05,182.48 132.47,183.91 C11.PLUS | 130.51,182.48 125.1,187.89 105.65,187.89 97.94,180.19 | TL1.2 22.71,105.22 | 22.71,105.22 22.21,105.22 11.58,115.85 11.58,126.55 16.74,131.71 21.26,131.71 25.14,127.83 32.37,127.83 74.81,170.27 74.81,173.87 69.46,179.22 69.46,186.02 75.72,192.28 89.91,192.28 97.94,184.25 97.94,180.19 | v21.04,103.54 22.71,105.22 | ULTRA_1.1 21.59,100.22 20.91,100.22 | 97.94,180.19 TL2.2 | v186.46,111.69 184.66,109.89 184.66,97.33 185.73,96.26 ULTRA_SISTEM.4 | v169.73,83.42 161.14,92.01 SMALL_LINE.4 153.49,92.01 KICKER.4 147.71,91.85 LINE_SISTEM.4 | POWER.6 POWER.2 67.3,122.09 62.66,117.44 v48.5,117.44
  Bottom 0.508: U1.4 199.44,93.36 199.23,93.58 199.23,94.59 | 209.04,95.81 207.72,95.81 206.87,94.96 U1.6 200.49,94.97 199.13,94.97 198.99,94.83 198.88,94.94 v198.07,94.94 | 209.04,95.81 U1.18 | ULTRA_SISTEM.4 189.48,96.26 190.94,94.8 190.94,92.16 ULTRA_3.1 193,90.16 v195.33,92.49 | ULTRA_2.1 108.67,180.78 101.85,180.78 55.86,134.79 55.86,124.8 v48.5,117.44 | C16.2 210.74,95.81 209.04,95.81 | v122.84,113.85 122.84,120.26 121.47,121.63 v117.59,121.63 | v120.9,125.7 132.47,125.7 v132.58,125.81
  Bottom 1.27: JP9.2 JP9.1 109.59,169.11 109.59,175.09 v109.7,175.2 | ULTRA_SISTEM.4 185.5,96.26 184.09,97.67 184.09,99.65 167.18,116.56 167.18,118.46 167.27,118.55 167.27,124.41 163.8,127.88 161.57,127.88 136.46,152.99 | 136.46,152.99 ULTRA_2.1 | JP6.9 124.94,21.92 124.94,27.83 v135.31,38.21 154.1,56.99 154.1,58.89 168.54,73.33 168.55,73.33 169.81,74.59 169.81,76.06 169.73,76.14 v169.73,83.42 179.54,93.23 179.54,97.78 v160.14,117.18 151.71,125.61 151.71,125.71 134.2,143.22 134.2,151.01 136.18,152.99 136.46,152.99 | JP3.10 18.4,74.93 18.4,101.81 20.13,103.54 v21.04,103.54 | JP4.1 193.48,112.6 192.57,111.69 v186.46,111.69 | ULTRA_1.1 30.04,99.05 48.43,117.44 v48.5,117.44
BATERY+  (via drill 0.7)  (1 unrouted)
  Top 1.016: IO1.1 31.35,77.2 v31.38,77.17
  Top 1.27: v31.37,92.17 C4.2 29.36,90.15 28.66,89.45 C6.PLUS | 128.87,171.77 C8.2 132.55,171.05 | C10.PLUS 143.68,187.89 143.68,176.31 139.89,172.52 139.89,171.42 137.88,169.41 | 137.88,169.41 134.19,169.41 132.55,171.05 | 137.88,169.41 141.49,169.41 180.23,130.67 v180.23,117.44 | 132.55,171.05 127.12,165.61 v119.99,165.61 | U$4.VIN_1 U$4.VIN | IO2.1 128.87,171.77 | 128.87,171.77 128.31,171.77
  Bottom 1.016: JP3.2 JP3.4 JP3.6 JP3.8
  Bottom 1.27: v180.23,117.44 182.11,115.56 JP4.9 JP4.7 JP4.5 JP4.3 | v119.99,165.61 119.95,165.57 110.31,165.57 97.25,152.51 JP9.3 JP9.7 JP9.9 95.53,142.21 94.08,140.76 74.8,140.76 62.55,128.51 62.55,108.93 62.93,108.54 | JP3.2 31.11,75.91 | 31.11,75.91 31.11,91.89 v31.38,92.16 v31.37,92.17 48.29,109.09 58.7,109.09 59.25,108.54 62.93,108.54 | v31.38,77.17 31.38,76.18 31.11,75.91 | U$4.VIN 123.82,80.33 105.61,98.54 77.15,98.54 70.27,105.42 FUSE.2 66.06,105.42 62.93,108.54
DRIBLER_A  (via drill 0.5)
  Top 0.508: CONTROL_BOARD.15 101.21,139.21 99.98,137.98 99.98,130.21 v97.07,127.3 | v97.11,103.26 91.72,97.87 U$4.INA
  Bottom 0.508: v97.07,127.3 97.07,103.3 v97.11,103.26
DRIBLER_B  (via drill 0.5)
  Top 0.508: CONTROL_BOARD.16 101.21,129.26 v99.66,127.71 | v99.46,103.32 99.46,90.61 U$4.INB
  Bottom 0.508: v99.66,127.71 99.66,103.52 v99.46,103.32
DRIBLER_OUT_A
  Top 1.27: DRIBLER.5 DRIBLER.1 | DRIBLER.1 | U$4.OUTA U$4.OUTA_1 125.12,90.87 125.12,75.25 DRIBLER.1 | DRIBLER.3 DRIBLER.1 | DRIBLER.1
DRIBLER_OUT_B
  Top 1.27: DRIBLER.2 | DRIBLER.2 134.53,73.03 134.53,84.61 131.19,87.95 U$4.OUTB_1 U$4.OUTB | DRIBLER.6 DRIBLER.2 | DRIBLER.4 DRIBLER.6 | DRIBLER.6
DRIBLER_PWM  (via drill 0.5)
  Top 0.508: U$4.PWM 93.97,90.49 98.35,94.87 v98.35,103.26 | v98.51,143.76 98.67,143.6 CONTROL_BOARD.17
  Bottom 0.508: v98.35,103.26 98.35,129.1 97.57,129.88 97.57,142.82 v98.51,143.76
DRIBLER_SIGNAL  (via drill 0.5)
  Top 0.508: v98.67,130.83 CONTROL_BOARD.18 | DRIBLER.8 148.65,60.97 148.65,78.28 132.9,94.03 132.9,101.7 v130.72,103.88 | v138.64,107.47 134.19,111.92 R1.2 134.19,122.51 130.62,126.08 121.73,126.08 121.25,126.56 120.54,126.56 120.06,126.08 v109.52,126.08
  Bottom 0.508: v109.52,126.08 105.37,130.23 99.27,130.23 v98.67,130.83 | v130.72,103.88 135.05,103.88 v138.64,107.47
GND  (via drill 0.5, 0.7)  (2 unrouted)
  Top 0.508: LED1.C 211.61,91.63 v210.84,92.4 | C12.1 106.61,106.33 C13.1 102.28,106.37 100.9,107.75 100.9,109.22 101.87,110.19 106.9,110.19 109.09,108 109.37,108 | 109.37,108 U2.3 112.9,108 113.7,107.2 U2.21 121.3,107.2 C15.1 121.51,114.41 RESET_LINE_SISTEM.3 | 109.37,108 109.37,106.66 109.63,106.4 U2.5 | LINE_SISTEM.6 132.49,112.15 R1.1 130.01,115.71 126.08,115.71 | U$4.GND_2 84.41,77.79 64.71,97.49 59.7,97.49 53.23,103.97 53.23,107.11 v46.65,113.69
  Top 1.016: IO1.3 26.36,69.67 23.06,69.67 23.06,77.1 IO1.5 | C6.MINUS | ULTRA_1.4 25.01,91.43 C4.1 25.75,94.28 | 25.75,94.28 25.75,96.28 C5.1 | D1.A 21.26,122.25 21.26,111.34 22.35,110.25 29.26,110.25 32.36,107.15 32.36,94.76 31.88,94.28 25.75,94.28
  Top 1.27: C6.MINUS 26.43,82.19 26.43,77.27 | C7.MINUS 21.05,80.36 21.05,77.79 21.64,77.2 IO1.5 | ULTRA_1.4 24.39,89.8 24.39,87.83 26.77,85.45 C6.MINUS | 122.11,180.9 122.11,181.35 C9.1 126.31,179.93 127.52,178.73 IO2.5 121.99,178.73 | 121.99,178.73 120.88,178.73 | IO2.6 111.72,181.95 105.11,181.95 102.77,179.61 ULTRA_2.4 102.77,172.53 | C10.MINUS 137.13,187.52 C11.MINUS 139.38,181.86 140.55,180.69 140.55,178.08 139.38,176.91 139.38,174.99 C8.1 132.61,175.32 IO2.3 122.52,175.32 | 102.77,172.53 102.77,171.1 100.53,168.86 83.46,168.86 | D2.A 76.54,188.87 72.52,184.85 72.52,179.8 83.46,168.86 | 136.11,149.09 v136.11,149.16 133.29,151.98 133.29,155.24 130.88,157.65 121.76,157.65 115.99,163.42 115.99,173.14 116.17,173.14 IO2.6 | v83.83,161.03 83.83,168.49 83.46,168.86 | v187.96,107.89 190.88,110.81 194.94,110.81 v196.93,112.8 | 30.35,67.93 v33.02,67.93 31.62,66.53 IO1.6 26.36,69.67 | v161.33,97.07 171.49,86.91 171.49,81.94 171.51,81.92 v171.55,81.92 | SMALL_LINE.6 153.49,97.09 KICKER.6 153.31,96.95 LINE_SISTEM.6 | POWER.5 POWER.1 87.63,115.71 RESET_LINE_SISTEM.3 126.08,115.71 RESET_LINE_SISTEM.4 | U$4.GND_1 U$4.GND | 102.77,172.53 109.81,172.53 112.6,175.32 IO2.6 | IO2.6 122.52,175.32 | 122.52,175.32 121.99,175.85 121.99,178.73
  Bottom 0.508: C1.1 195.82,105.3 C2.1 | v210.84,92.4 209.88,93.36 | 209.88,93.36 U1.21 202.05,93.36 | U1.5 201.25,94.16 202.05,93.36 | 202.05,93.36 201.25,92.56 U1.3 199.28,92.56 199.22,92.5 198.65,91.94 | 198.65,91.94 198.18,91.61 | ULTRA_RESET.4 187.99,84.61 | 198.65,91.94 192.94,97.65 ULTRA_3.4 | 182.84,89.71 183.5,89.71 | ULTRA_1.4 24.39,91.43 v46.65,113.69 56.86,123.9 56.86,124.54 56.72,124.68 56.72,133.91 v83.83,161.03 101.87,179.06 ULTRA_2.4 | 209.88,93.36 209.99,93.36 C16.1
  Bottom 1.27: 181.55,91.92 181.55,91.66 183.5,89.71 184.66,89.71 185.08,89.29 185.08,86.53 ULTRA_RESET.4 ULTRA_RESET.3 195.11,86.22 195.11,90.14 195.59,90.62 197.19,90.62 198.18,91.61 198.18,92.54 ULTRA_3.4 189.38,101.34 ULTRA_SISTEM.6 187.9,103.51 189.69,105.3 190.55,105.3 | 181.55,91.92 181.55,99.07 136.14,144.48 136.14,149.16 v136.11,149.16 | 90.28,152.68 JP9.4 | JP9.4 JP9.6 JP9.8 JP9.10 | JP9.4 87.09,152.51 83.83,155.77 v83.83,161.03 | 181.55,91.92 v171.55,81.92 171.29,81.66 171.29,58.87 BATERY_3.3 171.73,57.91 168.82,55 154.67,55 127.36,27.69 JP6.10 | 195.82,105.3 190.55,105.3 | 190.55,105.3 v187.96,107.89 | v196.93,112.8 196.93,119.01 201.73,123.81 201.73,126.95 199.85,128.83 192.78,128.83 187.88,123.93 187.88,121.16 JP4.6 | JP3.7 JP3.5 JP3.3 JP3.1 31.74,67.93 v33.02,67.93 | v161.33,97.07 161.31,97.09 SMALL_LINE.6 158.35,96.93 | U$4.GND 136.74,85.41 142.96,91.63 142.96,96.13 143.78,96.95 LINE_SISTEM.6 | U$4.GND_2 93.51,76 93.51,74.42 91.8,72.71 U$4.GND_3 | JP4.10 JP4.8 JP4.6 | JP4.6 JP4.4
INT_KICK  (via drill 0.5)
  Top 0.508: U2.32 112.31,112.99 v113.77,114.45 | v114.17,121.58 v117.61,125.02 | v127.65,138.45 v130.68,141.48
  Bottom 0.508: v113.77,114.45 113.77,121.18 v114.17,121.58 | v127.65,138.45 127.65,135.06 v117.61,125.02 | v130.68,141.48 128.16,144 128.16,148.94 127.13,149.97 JP8.5
INT_MOTOR_LINE_1  (via drill 0.5)
  Top 0.508: U2.2 109.77,108.8 v108.54,110.03 | v153.28,101.15 155.3,103.17 158.54,103.17 160.17,104.8 160.17,107.55 v169.21,116.6 | v182.45,129.55 183.16,129.55 184.68,128.04 186.21,128.04 189.85,124.39 190.98,124.39 v191.98,123.39
  Bottom 0.508: v108.54,110.03 109.75,111.24 114.55,111.24 124.64,101.15 v153.28,101.15 | v169.21,116.6 169.21,118.9 179.86,129.55 v182.45,129.55 | v191.98,123.39 193.48,121.89 JP4.2
INT_MOTOR_LINE_2  (via drill 0.5)
  Top 0.508: U2.1 108.96,111.45 101.16,111.45 99.96,110.25 99.96,107.99 v89.05,97.08
  Bottom 0.508: JP3.9 20.95,64.81 21.99,63.77 32.13,63.77 34.93,66.57 34.93,92.64 39.37,97.08 57.35,97.08 57.66,96.77 76.62,96.77 77.01,97.15 79.3,97.15 79.37,97.08 v89.05,97.08
INT_SMALL_LINE  (via drill 0.5)
  Top 0.508: U2.9 112.29,102.5 112.29,101.84 112.4,101.73 112.4,28.62 125.11,15.91 131.47,15.91 v131.51,15.95
  Bottom 0.508: JP6.5 132.44,16.88 v131.51,15.95
KICK  (via drill 0.5)
  Top 0.508: CONTROL_BOARD.20 93.42,138.35 93.42,143.19 95.94,145.71 v104.64,145.71
  Bottom 0.508: v104.64,145.71 113.28,145.71 117.54,149.97 JP8.6
LINE_INTERUPT  (via drill 0.5)
  Top 0.508: CONTROL_BOARD.19 96.13,139.3 97.37,138.06 97.37,128.54 96.63,128.54 95.76,127.67 95.76,126.58 96.03,126.31 v100.62,126.31 | v117.95,109.17 118.32,108.8 U2.23
  Bottom 0.508: v100.62,126.31 113.49,113.44 113.49,112.59 114.18,111.9 115.22,111.9 v117.95,109.18 v117.95,109.17
MISO  (via drill 0.5)
  Top 0.508: v208.72,99.17 208.72,77.88 v196.45,65.61 | v42.56,125.77 44.24,124.09 v58.45,124.09 | v61.15,122.37 61.21,122.43 v63.91,122.43 | v116.15,104.81 116.75,104.21 117.03,104.21 117.91,103.33 U2.16 | v168.57,75.54 171.56,72.55 171.56,63.34 176.31,58.59 v176.31,56.84 | v142.01,99.35 v137,104.36 | v140.19,107.55 144.33,111.7 144.34,111.7 153.99,121.34 v153.99,121.37
  Bottom 0.508: JP6.4 134.98,27.01 135.72,27.75 147.23,27.75 v176.31,56.84 177.69,58.21 183.09,58.21 187.79,62.91 190.35,62.91 | 190.35,62.91 190.94,63.5 JP5.3 | v208.72,99.17 208.72,98.86 207.92,98.06 U1.16 | v196.45,65.61 193.66,62.82 190.44,62.82 190.35,62.91 | JP2.8 23.49,124.02 27.3,127.83 40.5,127.83 v42.56,125.77 | v58.45,124.09 59.43,124.09 v61.15,122.37 | v63.91,122.43 65.98,120.36 66.78,120.36 68.67,118.47 73.19,118.47 75.4,116.26 75.4,115.33 77.33,113.4 77.33,106.88 82.37,101.84 107.02,101.84 108.31,100.55 109.2,100.55 111.52,102.87 111.52,105.52 112.4,106.4 114.56,106.4 v116.15,104.81 117.69,103.27 117.69,100.37 119.48,98.58 141.24,98.58 v142.01,99.35 | JP8.1 126.64,155.05 132.28,149.41 132.28,143.08 v153.99,121.37 178.14,97.22 178.14,93.74 168.57,84.17 v168.57,75.54 | v137,104.36 v140.19,107.55
MOSI  (via drill 0.5)
  Top 0.508: v178.35,57.34 185.35,64.34 v193.39,64.34 | v206.8,99.5 207.8,98.5 207.8,78.9 v196.38,67.48 | v115.85,103.75 115.86,103.75 116.07,103.55 116.75,103.55 116.99,103.31 116.99,102.63 U2.15 | v63.96,121.13 60.73,121.13 v60.7,121.16 | v43.38,126.45 43.38,126.21 44.56,125.03 v57.58,125.03 | v168.04,74.57 170.61,72.01 170.61,62.79 175.01,58.39 175.01,56.25 176.12,55.14 v176.14,55.14 | v143.74,99.45 v138.75,104.44 | v141.9,107.59 v154.18,119.88 v154.19,119.88
  Bottom 0.508: JP6.2 137.98,25.04 146.05,25.04 v176.14,55.14 v178.35,57.34 | v193.39,64.34 193.39,67.21 JP5.1 196.2,67.3 v196.38,67.48 | U1.15 v206.8,99.5 | v63.96,121.13 65.39,119.7 66.51,119.7 68.4,117.81 72.91,117.81 74.74,115.99 74.74,115.02 76.63,113.13 76.63,106.51 81.96,101.18 106.75,101.18 108.07,99.86 109.54,99.86 112.32,102.64 112.32,104.97 113.09,105.74 113.87,105.74 113.87,105.73 v115.85,103.75 115.85,98.3 116.52,97.62 141.91,97.62 v143.74,99.45 | v60.7,121.16 58.82,123.04 58.18,123.04 57.58,123.64 v57.58,125.03 | v43.38,126.45 41.18,128.64 26.21,128.64 20.88,123.31 20.88,120.71 JP2.10 | JP8.3 126.49,152.51 130.49,148.51 130.49,143.56 154.17,119.88 v154.19,119.88 154.19,119.83 177.14,96.88 177.14,94.03 167.71,84.6 167.71,75.19 167.74,75.16 167.74,74.88 v168.04,74.57 | v143.74,99.45 | v138.75,104.44 v141.9,107.59
MOTOR_A_A_1  (via drill 0.7)
  Top 0.508: v176.58,63.58 175.51,64.65 175.51,71.13 180.37,76 180.37,114.38 170.48,124.28 170.48,125.33 151.18,144.63 | 151.18,144.63 | 151.18,144.63 151.17,144.63 150.42,145.38 115.54,145.38 113.91,143.75 CONTROL_BOARD.5 113.91,141.14
  Bottom 0.508: JP5.9 183.32,63.63 181.6,61.91 178.24,61.91 v176.58,63.58
MOTOR_A_A_2  (via drill 0.5)
  Top 0.508: CONTROL_BOARD.8 111.37,131.84 106.58,127.06 105.98,127.06 103.97,125.05 103.97,124.44 101.9,122.37 86.86,122.37 81.06,128.18 81.06,132.7 78.91,134.85 69.67,134.85 68.17,133.35 68.17,130.73 58.26,120.82 41.94,120.82 v39.67,123.09
  Bottom 0.508: JP2.2 31.11,124.6 32,125.5 37.15,125.5 39.56,123.09 v39.67,123.09
MOTOR_A_B_1  (via drill 0.7)
  Top 0.508: v175.98,62.33 174.27,64.03 174.27,71.76 179.06,76.55 179.06,114.57 169.16,124.47 169.16,124.79 149.86,144.08 117.89,144.08 116.45,142.64 CONTROL_BOARD.3
  Bottom 0.508: JP5.7 185.86,64.55 181.68,60.37 177.93,60.37 v175.98,62.33
MOTOR_A_B_2  (via drill 0.5)
  Top 0.508: CONTROL_BOARD.10 108.83,131.35 101.19,123.71 87.42,123.71 82.39,128.73 82.39,133.26 79.46,136.19 69.12,136.19 66.83,133.91 66.83,130.33 58.66,122.16 42.49,122.16 v40.62,124.03
  Bottom 0.508: JP2.4 28.57,125.56 29.33,126.32 38.21,126.32 38.58,125.95 38.7,125.95 v40.62,124.03
MOTOR_A_PWM_1  (via drill 0.7)
  Top 0.508: v175.51,60.94 175.51,61.15 172.88,63.77 172.88,72.22 177.75,77.09 177.75,114.81 150.12,142.44 120.71,142.44 CONTROL_BOARD.1
  Bottom 0.508: JP5.5 188.4,65.61 182.33,59.54 176.91,59.54 v175.51,60.94
MOTOR_A_PWM_2  (via drill 0.5)
  Top 0.508: CONTROL_BOARD.12 106.29,130.77 100.56,125.04 87.97,125.04 83.73,129.28 83.73,133.81 80.01,137.53 68.56,137.53 65.5,134.46 65.5,129.93 58.8,123.23 43.31,123.23 v41.56,124.98
  Bottom 0.508: JP2.6 26.03,124.81 28.29,127.07 39.44,127.07 39.6,126.91 39.63,126.91 v41.56,124.98
MOTOR_B_A_1  (via drill 0.7)
  Top 0.508: v174.47,76.75 172.79,78.43 172.79,116.91 162.72,126.98 121.77,126.98 121.53,127.22 120.27,127.22 120.03,126.98 120.02,126.98 113.91,133.09 CONTROL_BOARD.6
  Bottom 0.508: JP5.10 178.84,72.38 v174.47,76.75
MOTOR_B_A_2  (via drill 0.5)
  Top 0.508: v48.84,128.58 54.81,128.58 72.75,146.51 72.75,154.14 75.54,156.93 108.19,156.93 111.37,153.75 CONTROL_BOARD.7
  Bottom 0.508: JP2.1 31.11,112.89 31.77,112.23 33.81,112.23 35.08,113.5 35.08,114.79 48.84,128.55 v48.84,128.58
MOTOR_B_B_1  (via drill 0.7)
  Top 0.508: v175.38,77.66 174.07,78.96 174.07,116.59 157.48,133.18 117.66,133.18 116.45,134.39 CONTROL_BOARD.4
  Bottom 0.508: JP5.8 185.86,74.6 185.33,75.13 177.88,75.13 175.38,77.63 v175.38,77.66
MOTOR_B_B_2  (via drill 0.5)
  Top 0.508: v48.94,127.29 55.28,127.29 73.99,146 73.99,153.63 76.05,155.69 105.68,155.69 108.77,152.61 108.77,140.78 CONTROL_BOARD.9
  Bottom 0.508: JP2.3 28.57,112.89 30.36,111.1 34.44,111.1 36.32,112.99 36.32,114.67 v48.94,127.29
MOTOR_B_PWM_1  (via drill 0.7)
  Top 0.508: v176.28,78.56 175.66,79.19 175.66,115.95 156.76,134.85 142.4,134.85 141.6,135.64 CONTROL_BOARD.2
  Bottom 0.508: JP5.6 188.4,74.6 186.93,76.07 179,76.07 176.51,78.56 v176.28,78.56
MOTOR_B_PWM_2  (via drill 0.5)
  Top 0.508: v49.05,126.03 55.78,126.03 75.23,145.49 75.23,153.11 76.57,154.45 103.31,154.45 106.29,151.47 CONTROL_BOARD.11
  Bottom 0.508: v49.05,126.03 37.56,114.54 37.56,112.47 34.95,109.86 30.12,109.86 26.03,113.96 JP2.5
N$1
  Bottom 2.54: BATERY_2.5 61.9,157.85 42.7,138.65 BATERY_1.3
N$2
  Bottom 2.54: BATERY_2.3 151.95,157.85 171.9,137.9 171.9,130.82 BATERY_3.5
N$3  (via drill 0.5)
  Top 1.27: IO2.2 129.11,173.72 v131.65,173.72 | D2.K 83.05,188.21 v84.81,186.45 84.81,175.93 TL2.1
  Bottom 1.27: v131.65,173.72 120.38,184.98 86.28,184.98 v84.81,186.45
N$4
  Top 2.54: MAIN_POWER.2 68.26,83.23 FUSE.1
N$5
  Top 0.508: Y2.2 106.45,108.27 C13.2 107.82,108.07 108.55,107.34 108.55,105.51 109.26,104.8 U2.7
N$6
  Top 1.016: D1.K 28.8,121.67 TL1.1 34.25,109.74 34.25,91.83 29.9,87.48 29.9,81.4 29.77,81.4 28.06,79.69 IO1.2
N$7
  Bottom 0.508: Y1.2 192.52,107.98 C2.2 198.74,105.06 198.74,96.81 199.79,95.76 U1.7
N$8  (via drill 0.5)
  Top 0.508: v199.92,98.42 196.5,98.42 Y1.1
  Bottom 0.508: C1.2 Y1.1 | v199.92,98.42 200.5,97.84 U1.8
N$9
  Top 0.508: Y2.1 106.39,103.19 C12.2 109.78,102.97 U2.8
N$12  (via drill 0.5)
  Top 0.508: LINE_SISTEM.1 146.42,84.25 144.43,86.24 144.43,91.62 | 144.43,91.62 144.43,91.76 | 144.43,91.62 144.41,91.62 129.07,106.96 v129.07,114.1 | v129.13,117.02 129.13,121.71 C14.2
  Bottom 0.508: v129.07,114.1 129.14,114.17 v129.14,117.01 v129.13,117.02
N$13  (via drill 0.5)
  Top 0.508: R2.1 C14.1 124.79,123.57 124.79,122.16 RESET_LINE_SISTEM.2 RESET_LINE_SISTEM.1 | U2.29 v114.71,113.19 v114.72,113.2
  Bottom 0.508: v114.72,113.2 115.97,113.2 116.67,113.9 116.67,118.35 118.55,120.23 RESET_LINE_SISTEM.1
N$16  (via drill 0.35)
  Top 0.508: v197.05,89.04 194.62,91.47 191.5,91.47 189.25,93.72 ULTRA_SISTEM.3
  Bottom 0.508: U1.30 203.6,86.61 202.93,85.94 200.15,85.94 v197.05,89.04
N$17  (via drill 0.35, 0.5)
  Top 0.508: ULTRA_SISTEM.2 183.98,91.18 181.56,88.76 181.56,78.57 195.39,78.57 v196.26,79.44 | v201.97,87.33 200.87,86.23 v200.87,84.54
  Bottom 0.508: v201.97,87.33 201.97,87.95 202.81,88.8 202.81,89.46 U1.31 | v196.26,79.44 196.39,79.44 196.39,80.06 v200.87,84.54
N$18
  Top 0.508: C3.2 185.4,88.64 ULTRA_SISTEM.1
N$19  (via drill 0.35)
  Top 0.508: ULTRA_RESET.2 186.66,79.75 R8.1 | v183.16,88.26 184.74,89.84 C3.1
  Bottom 0.508: U1.29 204.4,85.93 197.98,79.51 197.98,78.54 194.86,78.54 194.86,78.73 ULTRA_RESET.1 ULTRA_RESET.2 183.16,83.93 v183.16,88.26
N$20
  Top 0.508: R5.1 213.02,93.18 LED1.A
RAW_BATERY+
  Top 2.54: BATERY_1.5 42.7,75.13 55.5,87.93 MAIN_POWER.1
RESET_KICK
  Bottom 0.508: JP8.9 160.77,109.65 160.77,101.19 159.85,100.27 157.38,100.27 156.1,98.99 156.1,85.26 155.07,84.23 KICKER.1
RESET_SMALL_LINE  (via drill 0.7)
  Top 0.508: v141.72,38.2 158.45,54.94 158.45,62.1 165.88,69.53 165.88,81.72 163.21,84.39 SMALL_LINE.1
  Bottom 0.508: JP6.6 132.44,28.92 v141.72,38.2 | v141.72,38.2
RX_KICK
  Bottom 0.508: KICKER.3 155.42,91.4 155.42,104.01 154.63,104.8 154.63,114.55 125.94,143.24 123.97,143.24 122.99,144.22 122.99,146.2 124.53,147.74 125.22,147.74 JP8.7
RX_LINE_SISTEM  (via drill 0.5)
  Top 0.508: U2.30 v113.91,109.81
  Bottom 0.508: v113.91,109.81 123.36,100.36 147.9,100.36 149.9,98.36 149.9,91.54 LINE_SISTEM.3
RX_SMALL_LINE  (via drill 0.7)
  Top 0.508: v139.96,38.07 157.26,55.37 157.26,62.59 164.69,70.02 164.69,81.49 163.91,82.27 157.7,82.27 155.63,84.34 155.63,87.85 157.25,89.47 SMALL_LINE.3
  Bottom 0.508: JP6.8 129.9,28.04 139.93,38.07 v139.96,38.07
SCK  (via drill 0.5)
  Top 0.508: v210.84,97.95 211.75,97.95 R5.2 | v35.77,108.75 43.29,116.27 v65.8,116.27 | v181.26,56.67 187.32,62.72 193.98,62.72 195.06,63.8 195.06,72.56 192.2,75.42 v190.94,75.42 | v113.18,104.61 114.3,105.73 116.85,105.73 118.46,104.12 119.28,104.12 U2.17 119.44,104.04 121.58,104.04 | 121.58,104.04 | v147.28,77.96 147.28,78.34 127.67,97.95 127.67,98.95 128.54,99.82 128.54,103.47 127.96,104.04 v124.07,104.04 121.58,104.04
  Bottom 0.508: U1.17 210.45,97.92 210.84,97.92 | 210.84,97.92 v210.84,97.95 | JP5.4 v190.94,75.42 192.59,77.07 197.91,77.07 212.98,92.14 212.98,96.46 211.52,97.92 210.84,97.92 | JP2.7 23.81,115.24 23.81,111.69 26.75,108.75 v35.77,108.75 | JP6.3 134.98,15.86 | 134.98,15.86 137.13,13.71 139.29,13.71 139.93,14.35 139.93,17.5 179.09,56.67 v181.26,56.67 | v65.8,116.27 81.55,100.52 106.47,100.52 107.8,99.19 109.84,99.19 113.18,102.53 v113.18,104.61 | v147.28,77.96 147.28,67.54 151.46,63.36 151.46,56.48 123.45,28.47 123.45,20.13 129.46,14.12 133.24,14.12 134.98,15.86 | v124.07,104.04 124.07,120.24 121.67,122.64 117.07,122.64 103.19,136.52 103.19,146.72 111.52,155.05 JP8.2
SCL  (via drill 0.5)
  Top 0.508: CONTROL_BOARD.14 103.75,132 v104.14,131.61 | U2.28 115.51,112.78 115.58,112.85 115.58,114.12 v115.48,114.22
  Bottom 0.508: v104.14,131.61 105.98,131.61 115.48,122.11 v115.48,114.22
SDA  (via drill 0.5)
  Top 0.508: CONTROL_BOARD.13 103.75,143.06 101.88,144.93 96.83,144.93 94.52,142.62 v94.52,138.91 | v95.86,117.08 v118.05,117.08 | U2.27 116.31,112.21 v117.34,113.24
  Bottom 0.508: v94.52,138.91 96.29,137.14 96.29,128.18 95.86,127.75 v95.86,117.08 | v117.34,113.24 118.05,113.95 v118.05,117.08
SS_KICK  (via drill 0.5)
  Top 0.508: v112.62,146.85 112.67,146.8 112.67,127.98 112.07,127.38 109.12,127.38 108.13,126.4 106.25,126.4 104.63,124.77 104.63,122.48 106.17,120.94 106.17,118.17 v106.19,118.15 | v108.62,101.46 v111.49,98.59 | v113.96,98.59 113.91,98.64 U2.11
  Bottom 0.508: JP8.4 118.28,152.51 v112.62,146.85 | v106.19,118.15 106.19,103.89 v108.62,101.46 | v111.49,98.59 v113.96,98.59
SS_MOTOR_1  (via drill 0.5)
  Top 0.508: U2.13 115.51,100.49 116.3,99.7 126.69,99.7 127.68,100.69 v127.68,102.82 | v152.49,103.86 152.49,106.17 166.1,119.78 v168.61,119.78 | v181.61,130.51 183.14,130.51 184.95,128.7 186.48,128.7 190.13,125.05 194.31,125.05 208.36,111 208.36,101.14 209.71,99.79 209.71,77.34 v200.28,67.91
  Bottom 0.508: v127.68,102.82 127.74,102.88 151.51,102.88 v152.49,103.86 | v168.61,119.78 179.34,130.51 v181.61,130.51 | v200.28,67.91 197.95,67.91 JP5.2
SS_MOTOR_2  (via drill 0.5)
  Top 0.508: v35.41,107.36 36.59,107.36 44.71,115.48 65.13,115.48 v65.63,114.98 | v114.33,104.05 114.71,103.67 U2.12
  Bottom 0.508: JP2.9 20.95,112.33 25.92,107.36 v35.41,107.36 | v65.63,114.98 80.8,99.81 105.96,99.81 107.3,98.47 110.1,98.47 111.44,99.81 113.98,99.81 114.33,100.16 v114.33,104.05
SS_SMALL_LINE  (via drill 0.5)
  Top 0.508: v137.77,15.98 113.09,40.66 113.09,87.87 113.06,87.9 113.06,98.05 113.11,98.1 113.11,98.23 113.1,98.24 113.1,98.95 113.11,98.96 U2.10
  Bottom 0.508: v137.77,15.98 137.77,19.25 JP6.1
SS_ULTRA  (via drill 0.5)
  Top 0.508: U2.14 116.31,101.34 117.29,100.36 123.92,100.36 v125.68,102.12 | v152.94,102.52 154.63,104.21 154.63,107.09 165.05,117.51 v170.46,117.51 | v206,101.22 206,109.33 197.84,117.49 194.99,117.49 185.1,127.38 184.41,127.38 183.6,128.18 v182.98,128.18
  Bottom 0.508: v152.94,102.52 152.35,101.93 125.87,101.93 v125.68,102.12 | v170.46,117.51 181.13,128.18 v182.98,128.18 | v206,101.22 206,99.92 205.9,99.82 205.9,99.19 206,99.09 U1.14
TX_KICK
  Bottom 0.508: JP8.8 118.01,147.43 117.28,146.7 117.28,144.11 118.22,143.17 122.7,143.17 123.92,141.95 125.83,141.95 153.5,114.28 153.5,104.38 154.65,103.23 154.65,100.16 153.5,99.01 152.31,99.01 151.24,97.94 151.24,87.44 151.91,86.77 KICKER.2
TX_LINE_SISTEM  (via drill 0.5)
  Top 0.508: U2.31 113.11,110.23 112.85,109.97 112.85,109.38 v113.04,109.18 | v138.71,99.45 145.34,92.82 145.34,87.12 145.67,86.79 LINE_SISTEM.2
  Bottom 0.508: v138.71,99.45 138.61,99.55 122.67,99.55 117.6,104.63 117.6,104.64 117.09,105.14 117.08,105.14 v113.04,109.18
TX_SMALL_LINE  (via drill 0.7)
  Top 0.508: v141.66,36.56 159.65,54.55 159.65,61.6 167.08,69.03 167.08,82.02 162.17,86.93 SMALL_LINE.2
  Bottom 0.508: JP6.7 129.9,20.79 131.15,22.04 133.12,22.04 133.71,22.63 133.71,28.61 141.37,36.27 | 141.37,36.27 | 141.37,36.27 v141.66,36.56
U1
  Top 0.508: ULTRA_1.2 ULTRA_1.3
  Bottom 0.508: U1.9 201.76,98.3 201.76,109.01 200.82,109.95 178.76,109.95 178.03,110.68 178.03,117.71 181.23,120.91 181.23,123.36 184.55,126.68 184.55,129.1 182.23,131.42 178.5,131.42 174.45,127.37 170.69,127.37 147.51,150.55 147.27,150.79 145.27,152.79 139.97,152.79 110.46,182.3 101.14,182.3 54.44,135.6 54.44,125.18 30.45,101.19 21.5,101.19 19.98,99.67 19.98,97.54 21.01,96.51 ULTRA_1.2
U2  (via drill 0.5, 0.7)
  Top 0.508: v202.8,99.68 201.53,100.95 201.53,107.45 198.75,110.23 198.75,113.62 196.86,115.51 180.53,115.51 172.25,123.8 172.25,125.73 151.74,146.24 139.83,146.24 138.23,147.84 138.23,149.19 135.67,151.75 135.67,155.18 128.57,162.28 120.29,162.28 118.53,164.04 v118.53,167.72
  Bottom 0.508: U1.10 v202.8,99.68 | ULTRA_2.3 ULTRA_2.2 108.07,179.06 111.35,175.78 111.35,174.9 v118.53,167.72
U3  (via drill 0.5)
  Top 0.508: ULTRA_3.2 ULTRA_3.3 195.15,95.24 196.06,96.15 203.02,96.15 v203.56,96.69
  Bottom 0.508: U1.11 203.6,96.73 v203.56,96.69

### Text on the board
tNames: --> | B | C | - | + | --> | + | - | GND | - | + | Jakub Gal | 2020 | <-- | A | <-- | D